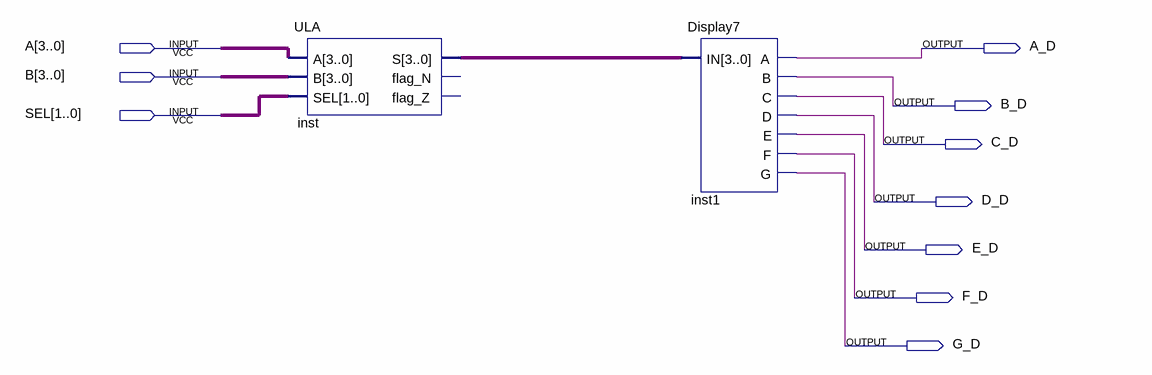
[diagram p0: schematic sheet]
// Quartus schematic LAB06.bdf as structural Verilog: 2 symbols, 10 pins
module LAB06 (
  input  [3:0] A,
  input  [3:0] B,
  input  [1:0] SEL,
  output A_D,
  output B_D,
  output C_D,
  output D_D,
  output E_D,
  output F_D,
  output G_D
);

  wire [3:0] inst_s;

  ULA inst (.A(A), .B(B), .SEL(SEL), .S(inst_s));  // open: flag_N, flag_Z
  Display7 inst1 (.IN(inst_s), .A(A_D), .B(B_D), .C(C_D), .D(D_D), .E(E_D), .F(F_D), .G(G_D));
endmodule
